# EAGLE design LearningBoard (EAGLE 7.3.0)
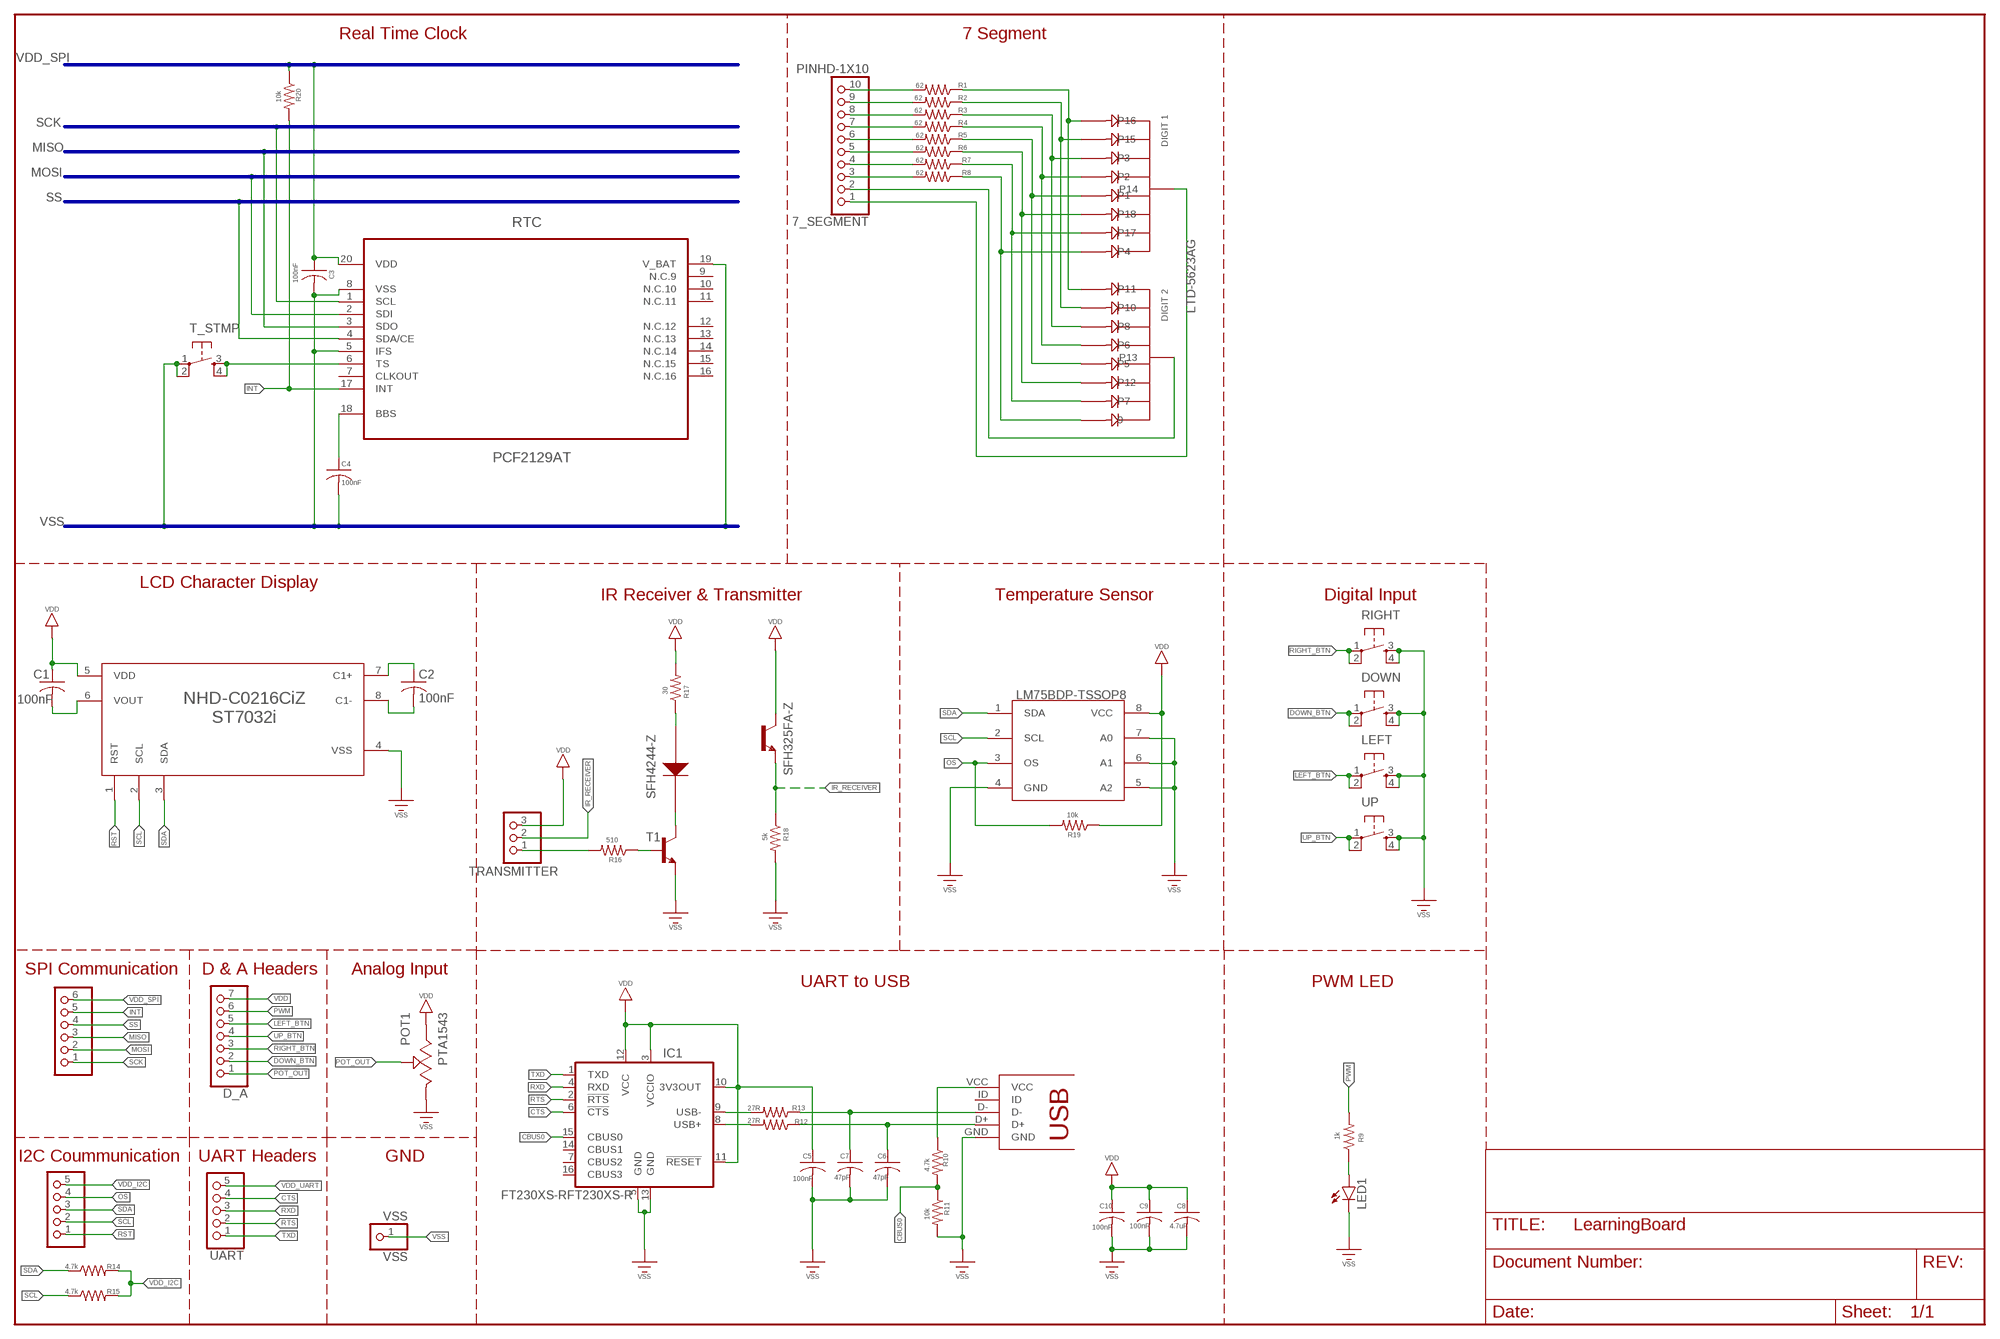
[diagram p0: schematic, sheet 1]

## Parts
7_SEGMENT  PINHD-1X10  [1X10-BIG]
C1  100nF  C-USC0805  [C0805]
C2  100nF  C-USC0805  [C0805]
C3  100nF  C-USC0805  [C0805]
C4  100nF  C-USC0805  [C0805]
C5  100nF  C-USC0805  [C0805]
C6  47pF  C-USC0805  [C0805]
C7  47pF  C-USC0805  [C0805]
C8  4.7uF  C-USC0805  [C0805]
C9  100nF  C-USC0805  [C0805]
C10  100nF  C-USC0805  [C0805]
D_A  PINHD-1X7  [1X07]
DOWN  TAC_SWITCHPTH  [TACTILE-PTH]
I2C  PINHD-1X5  [1X05]
IC1  FT230XS-RFT230XS-R  [FT230XS-R]
LED1  LED5MM  [LED5MM]
LEFT  TAC_SWITCHPTH  [TACTILE-PTH]
POT1  PTA1543  [PTA1543]
R1  62  RESISTOR0805-RES  [0805]
R2  62  RESISTOR0805-RES  [0805]
R3  62  RESISTOR0805-RES  [0805]
R4  62  RESISTOR0805-RES  [0805]
R5  62  RESISTOR0805-RES  [0805]
R6  62  RESISTOR0805-RES  [0805]
R7  62  RESISTOR0805-RES  [0805]
R8  62  RESISTOR0805-RES  [0805]
R9  1k  RESISTOR0805-RES  [0805]
R10  4.7k  RESISTOR0805-RES  [0805]
R11  10k  RESISTOR0805-RES  [0805]
R12  27R  RESISTOR0805-RES  [0805]
R13  27R  RESISTOR0805-RES  [0805]
R14  4.7k  RESISTOR0805-RES  [0805]
R15  4.7k  RESISTOR0805-RES  [0805]
R16  510  RESISTOR0805-RES  [0805]
R17  30  RESISTOR0805-RES  [0805]
R18  5k  RESISTOR0805-RES  [0805]
R19  10k  RESISTOR0805-RES  [0805]
R20  10k  RESISTOR0805-RES  [0805]
RECEIVER_  SFH325FA-Z  [SFH325FA-Z]
RIGHT  TAC_SWITCHPTH  [TACTILE-PTH]
SPI  PINHD-1X6  [1X06]
T1  MMBT3904LT1-NPN-SOT23-BEC  [SOT23-BEC]
T_STMP  TAC_SWITCHPTH  [TACTILE-PTH]
TRANSMITTER  PINHD-1X3  [1X03]
TRANSMITTER_  SFH4244-Z  [SFH4244-Z]
U$1  PCF2129AT  [PCF2129AT]
U$2  NHD-C0216CIZ-FN-FBW-3V  [NHD-C0216CIZ-FN-FBW-3V]
U$3  LTD-5623AG  [LTD-5623AG]
U$10  10118192-0001LF  [10118192-0001LF]
U$11  LM75BDP-TSSOP8  [TSSOP8]
UART  PINHD-1X5  [1X05]
UP  TAC_SWITCHPTH  [TACTILE-PTH]
VSS  VSS  PINHD-1X1  [1X01]

## Nets
CBUS0: IC1.15(CBUS0) R10.2 R11.1
CTS: IC1.6(!CTS) UART.4
DIN: R16.2 TRANSMITTER.1
DOWN_BTN: D_A.2 DOWN.1 DOWN.2
INT: R20.2 SPI.5 U$1.17(INT)
IR_RECEIVER: R18.1 RECEIVER_.E TRANSMITTER.2
LEFT_BTN: D_A.5 LEFT.1 LEFT.2
MISO: SPI.3 U$1.3(SDO)
MOSI: SPI.2 U$1.2(SDI)
N$1: C1.2 U$2.6(VOUT)
N$2: C2.1 U$2.7(C1+)
N$3: C2.2 U$2.8(C1-)
N$4: LED1.A R9.1
N$5: R1.1 U$3.P11 U$3.P16
N$6: R2.1 U$3.P10 U$3.P15
N$8: R4.1 U$3.P2 U$3.P6
N$9: R3.1 U$3.P3 U$3.P8
N$10: R5.1 U$3.P1 U$3.P5
N$11: R6.1 U$3.P12 U$3.P18
N$12: R7.1 U$3.P7 U$3.P17
N$13: R8.1 U$3.P4 U$3.P9
N$14: 7_SEGMENT.10 R1.2
N$15: 7_SEGMENT.9 R2.2
N$16: 7_SEGMENT.8 R3.2
N$17: 7_SEGMENT.7 R4.2
N$18: 7_SEGMENT.6 R5.2
N$19: 7_SEGMENT.5 R6.2
N$20: 7_SEGMENT.4 R7.2
N$21: 7_SEGMENT.3 R8.2
N$22: 7_SEGMENT.2 U$3.P13
N$23: 7_SEGMENT.1 U$3.P14
N$24: T1.C TRANSMITTER_.C
N$25: R17.1 TRANSMITTER_.A
N$26: R16.1 T1.B
N$27: T_STMP.3 T_STMP.4 U$1.6(TS)
N$30: C4.1 U$1.18(BBS)
N$33: IC1.9(USB-) R13.2
N$34: C7.1 R13.1 U$10.D-
N$35: C6.1 R12.1 U$10.D+
N$36: IC1.8(USB+) R12.2
N$38: R10.1 U$10.VCC
OS: I2C.4 R19.2 U$11.3(OS)
POT_OUT: D_A.1 POT1.2
PWM: D_A.6 R9.2
RIGHT_BTN: D_A.3 RIGHT.1 RIGHT.2
RST: I2C.1 U$2.1(RST)
RTS: IC1.2(!RTS) UART.2
RXD: IC1.4(RXD) UART.3
SCK: SPI.1 U$1.1(SCL)
SCL: I2C.2 R15.1 U$2.2(SCL) U$11.2(SCL)
SDA: I2C.3 R14.1 U$2.3(SDA) U$11.1(SDA)
SS: SPI.4 U$1.4(SDA/CE)
TXD: IC1.1(TXD) UART.1
UP_BTN: D_A.4 UP.1 UP.2
VDD: D_A.7 POT1.3
VDD_I2C: C1.1 I2C.5 R14.2 R15.2 R19.1 U$2.5(VDD) U$11.8(VCC) ; supply symbol labelled VDD
VDD_IR: R17.2 RECEIVER_.C TRANSMITTER.3 ; supply symbol labelled VDD
VDD_SPI: C3.1 R20.1 SPI.6 U$1.20(VDD)
VDD_UART: C5.1 C8.1 C9.1 C10.1 IC1.3(VCCIO) IC1.10(3V3OUT) IC1.11(!RESET) IC1.12(VCC) UART.5 ; supply symbol labelled VDD
VSS: C3.2 C4.2 C5.2 C6.2 C7.2 C8.2 C9.2 C10.2 DOWN.3 DOWN.4 IC1.5(GND) IC1.13(GND) LED1.K(C) LEFT.3 LEFT.4 POT1.1 R11.2 R18.2 RIGHT.3 RIGHT.4 T1.E T_STMP.1 T_STMP.2 U$1.5(IFS) U$1.8(VSS) U$1.19(V_BAT) U$2.4(VSS) U$10.GND U$11.4(GND) U$11.5(A2) U$11.6(A1) U$11.7(A0) UP.3 UP.4 VSS.1
Unconnected: IC1.7(CBUS2) IC1.14(CBUS1) IC1.16(CBUS3) U$1.7(CLKOUT) U$1.9(N.C.9) U$1.10(N.C.10) U$1.11(N.C.11) U$1.12(N.C.12) U$1.13(N.C.13) U$1.14(N.C.14) U$1.15(N.C.15) U$1.16(N.C.16) U$10.ID

## Buses
VDD_SPI
SCK
MISO
MOSI
SS
VSS

## Notes on the sheet
- Real Time Clock | 7 Segment
- LCD Character Display
- IR Receiver & Transmitter | Temperature Sensor | Digital Input
- SPI Communication | D & A Headers | Analog Input
- UART to USB | PWM LED
- I2C Coummunication | UART Headers | GND

## Library data of the parts
7_SEGMENT = adafruit:PINHD-1X10: Pin header 1x10 0.1" spacing With round pins
C1-C10 = resistor:C-US: CAPACITOR, American symbol
D_A = pinhead:PINHD-1X7: PIN HEADER
DOWN LEFT RIGHT T_STMP UP = SparkFun-Electromechanical:TAC_SWITCH: Momentary Switch Button commonly used for reset or general input. Spark Fun Electronics SKU : COM-00097 SMT- SWCH-08247
I2C UART = pinhead:PINHD-1X5: PIN HEADER
IC1 = AllAboutEE:FT230XS-R: BASIC USB to UART IC
LED1 = SparkFun-LED:LED: LEDs Standard schematic elements and footprints for 5mm, 3mm, 1206, and 0603 sized LEDs. 5mm - Spark Fun Electronics SKU : COM-00529 (and others)
POT1 = AllAboutEE:PTA1543: Slide Potentiometers 10MM SHAFT NO DET 15MM STRK SNG LIN 10 kOhms 50 mW 20 %; POWER_RATING: 50mW; RESISTANCE: 10kOhms; TOLERANCE: 20%
R1-R20 = SparkFun-Passives:RESISTOR: Resistor Basic schematic elements and footprints for 0603, 1206, and PTH resistors.
RECEIVER_ = AllAboutEE:SFH325FA-Z: PHOTOTRANSISTOR; IC_ON_MAX: 15mA; MF: Osram Opto Semiconductor; MPN: SFH 325 FA-Z; VCE_SAT: 150mV; WAVELENGTH: 980nm
SPI = pinhead:PINHD-1X6: PIN HEADER
T1 = transistor:*-NPN-: NPN Transistror BF959 corrected 2008.03.06
TRANSMITTER = pinhead:PINHD-1X3: PIN HEADER
TRANSMITTER_ = AllAboutEE:SFH4244-Z: Infrared Emitters - High Power HIGH PWR 940nm HALF ANGLE +/-60DEG
U$1 = AllAboutEE:PCF2129AT
U$2 = AllAboutEE:NHD-C0216CIZ-FN-FBW-3V: LCD Character Display Modules & Accessories; CONTROLLER: ST7032i-oD; COUNT_LINE: 16x2; DISPLAY_MODE: Transflective; INTERFACE: I2C; MANUFACTURER: Newhaven Display; VSUPPLY: 3v; VSUPPLY_MAX: 3.3v
U$3 = AllAboutEE:LTD-5623AG
U$10 = AllAboutEE:10118192-0001LF: USB Connectors 5P MICRO USB TYPE B RECEPTACLE.; COLOR: Black; GENDER: Female
U$11 = AllAboutEE:LM75BDP-TSSOP8; INTERFACE: I2C, 2-Wire, SMBus; MAX_OPERATING_TEMPERATURE: +125C; MINIMUM_OPERATING_TEMPERATURE: -55C; RESOLUTION: 11 bit; VSUPPLY_MAX: 5.5v; VSUPPLY_MIN: 2.8v
VSS = pinhead:PINHD-1X1: PIN HEADER

## Board
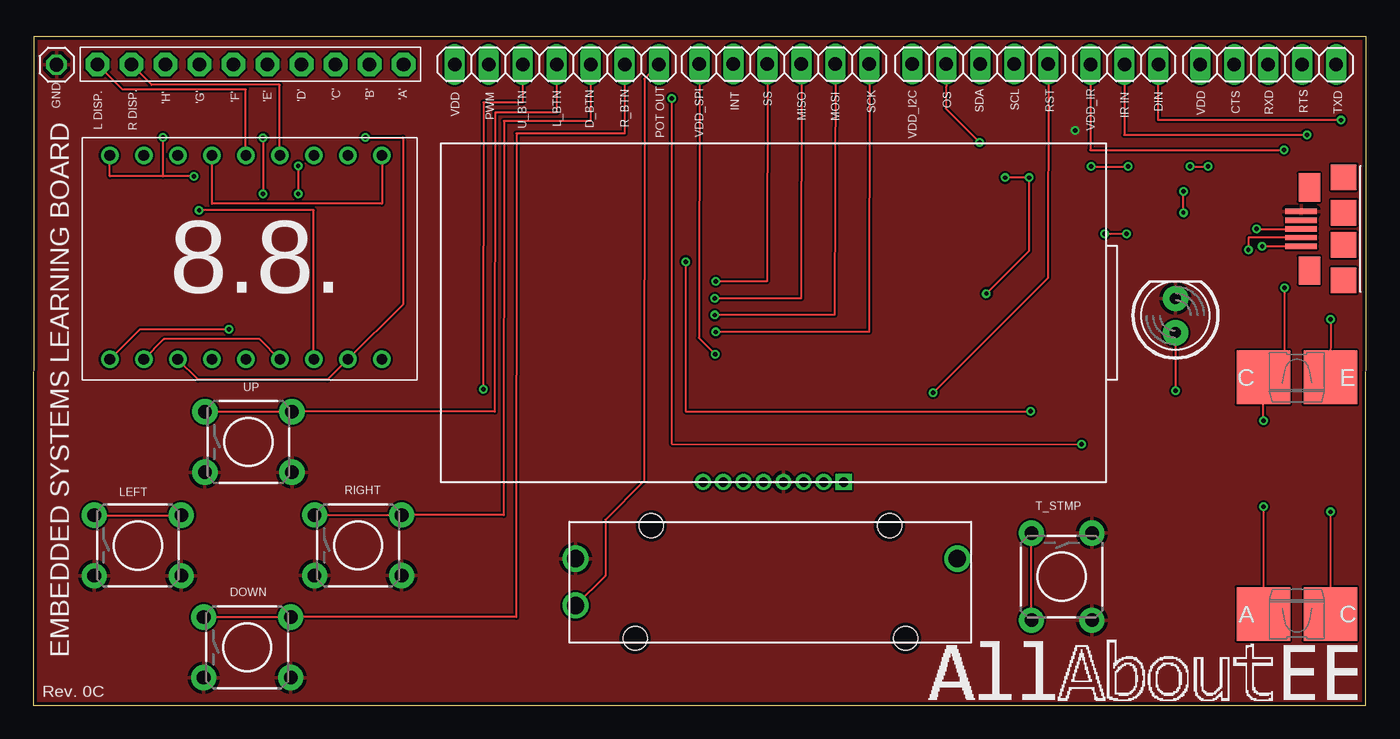
[diagram p1: board, top side]
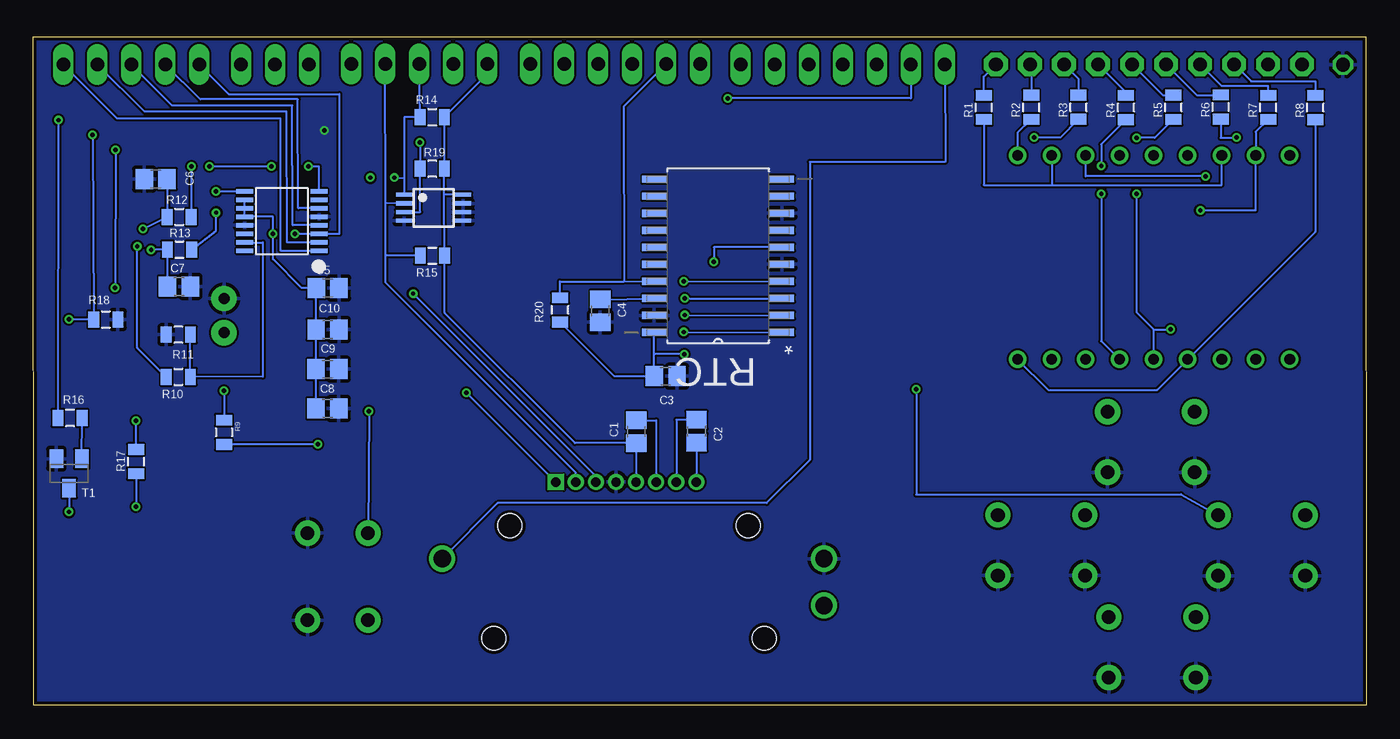
[diagram p2: board, bottom side, seen from below]

Size 99.49 x 49.93 mm. Coordinates in mm from the lower left corner, seen from the top.
Outline: 0,0 99.47,0 99.49,49.93 0.03,49.93 0,0
Copper layers (1*16): Top 0.035mm / dielectric 1.5mm / Bottom 0.035mm
Design rules "SeedStudio_2Layer": minimum track width 6mil, minimum drill 12mil, track to track 6mil, track to pad 6mil, pad to pad 6mil, via to via 6mil, smd to smd 0mil, copper to edge 10mil, drill to drill 10mil, minimum pad ring 10mil, minimum via ring 6mil, stop-mask expansion 2mil, vias tented up to drill 100mil, thermal gap 10mil

### Footprints (pad centres in the part's own frame; a part is rotated, then mirrored left to right if it is on the bottom)
1X10-BIG = drill 1.016 pad 1.778 octagon: 1 -11.43,0; 2 -8.89,0; 3 -6.35,0; 4 -3.81,0; 5 -1.27,0; 6 1.27,0; 7 3.81,0; 8 6.35,0; 9 8.89,0; 10 11.43,0
C0805 = smd 1.3 x 1.5: 1 -0.85,0; 2 0.85,0
1X07 = drill 1.016 long: 1 -7.62,0; 2 -5.08,0; 3 -2.54,0; 4 0,0; 5 2.54,0; 6 5.08,0; 7 7.62,0
TACTILE-PTH = drill 1.016 pad 1.88: 1 -3.251,2.261; 2 3.251,2.261; 3 -3.251,-2.261; 4 3.251,-2.261
1X05 = drill 1.016 long: 1 -5.08,0; 2 -2.54,0; 3 0,0; 4 2.54,0; 5 5.08,0
FT230XS-R = smd 0.32 x 1.26: 1 -2.223,-2.779; 2 -1.588,-2.779; 3 -0.953,-2.779; 4 -0.318,-2.779; 5 0.317,-2.779; 6 0.952,-2.779; 7 1.587,-2.779; 8 2.222,-2.779; 9 2.222,2.779; 10 1.587,2.779; 11 0.952,2.779; 12 0.317,2.779; 13 -0.318,2.779; 14 -0.953,2.779; 15 -1.588,2.779; 16 -2.223,2.779
LED5MM = drill 0.813 pad 1.88: A -1.27,0; K 1.27,0
PTA1543 = drill 1.3: 1 0.45,6.25; 2 0.45,2.75; 3 28.95,6.25 | hole 1.8: 4.9,0.3; 6.1,8.7; 23.9,8.7; 25.1,0.3
0805 = smd 0.8 x 1.2: 1 -0.9,0; 2 0.9,0
SFH325FA-Z = smd 4 x 4: C 0,-2.5; E 0,2.5
1X06 = drill 1.016 long: 1 -6.35,0; 2 -3.81,0; 3 -1.27,0; 4 1.27,0; 5 3.81,0; 6 6.35,0
SOT23-BEC = smd 1 x 1.4: B -0.95,-1.1; C 0,1.1; E 0.95,-1.1
1X03 = drill 1.016 long: 1 -2.54,0; 2 0,0; 3 2.54,0
SFH4244-Z = smd 4 x 4: A 0,2.5; C 0,-2.5
PCF2129AT = smd 1.803 x 0.533: 1 -4.775,5.715; 2 -4.775,4.445; 3 -4.775,3.175; 4 -4.775,1.905; 5 -4.775,0.635; 6 -4.775,-0.635; 7 -4.775,-1.905; 8 -4.775,-3.175; 9 -4.775,-4.445; 10 -4.775,-5.715; 11 4.775,-5.715; 12 4.775,-4.445; 13 4.775,-3.175; 14 4.775,-1.905; 15 4.775,-0.635; 16 4.775,0.635; 17 4.775,1.905; 18 4.775,3.175; 19 4.775,4.445; 20 4.775,5.715
NHD-C0216CIZ-FN-FBW-3V = drill 0.7 square: 1 30.1,-25.3 | drill 0.7: 2 28.6,-25.3; 3 27.1,-25.3; 4 25.6,-25.3; 5 24.1,-25.3; 6 22.6,-25.3; 7 21.1,-25.3; 8 19.6,-25.3
LTD-5623AG = drill 0.8: P1 2.04,1.54; P2 4.58,1.54; P3 7.12,1.54; P4 9.66,1.54; P5 12.2,1.54; P6 14.74,1.54; P7 17.28,1.54; P8 19.82,1.54; P9 22.36,1.54; P10 22.36,16.78; P11 19.82,16.78; P12 17.28,16.78; P13 14.74,16.78; P14 12.2,16.78; P15 9.66,16.78; P16 7.12,16.78; P17 4.58,16.78; P18 2.04,16.78
10118192-0001LF = smd 0.4 x 2.35: D+ -0.05,1.725; D- -0.7,1.725; GND 1.25,1.725; ID 0.6,1.725; VCC -1.35,1.725 | smd 2.1 x 1.6: P$1 -3.15,1.1; P$2 3.05,1.1 | smd 1.9 x 1.9: P$3 -3.9,-1.45; P$4 -1.25,-1.45; P$5 1.15,-1.45; P$6 3.8,-1.45
TSSOP8 = smd 1.2 x 0.305: 1 -2.2,0.975; 2 -2.2,0.325; 3 -2.2,-0.325; 4 -2.2,-0.975; 5 2.2,-0.975; 6 2.2,-0.325; 7 2.2,0.325; 8 2.2,0.975
1X01 = drill 1.016 octagon: 1 0,0

### Placement (x,y rotation side)
7_SEGMENT  16.2,47.85 0 top
C1  54.49,20.42 90 bottom
C2  49.99,20.46 270 bottom
C3  52.29,24.57 0 bottom
C4  57.17,29.44 270 bottom
C5  77.53,31.15 0 bottom
C6  90.36,39.28 180 bottom
C7  88.64,31.26 0 bottom
C8  77.55,22.15 0 bottom
C9  77.55,25.09 0 bottom
C10  77.54,28.05 0 bottom
D_A  39.07,47.85 180 top
DOWN  15.96,4.32 0 top
I2C  70.69,47.87 180 top
IC1  80.95,36.15 90 bottom
LED1  85.27,29.08 90 top
LEFT  7.79,11.92 0 top
POT1  40.02,4.69 0 top
R1  28.54,44.63 90 bottom
R2  25,44.65 90 bottom
R3  21.47,44.65 90 bottom
R4  17.93,44.63 90 bottom
R5  14.39,44.65 90 bottom
R6  10.84,44.66 90 bottom
R7  7.31,44.64 90 bottom
R8  3.79,44.63 90 bottom
R9  85.27,20.37 270 bottom
R10  88.68,24.51 0 bottom
R11  88.68,27.67 180 bottom
R12  88.61,36.45 0 bottom
R13  88.59,34.02 0 bottom
R14  69.73,43.91 0 bottom
R15  69.7,33.56 0 bottom
R16  96.76,21.44 180 bottom
R17  91.83,18.19 90 bottom
R18  94.09,28.8 0 bottom
R19  69.72,40.06 180 bottom
R20  60.18,29.51 90 bottom
RECEIVER_  94.34,24.48 270 top
RIGHT  24.24,11.93 0 top
SPI  56.06,47.87 180 top
T1  96.83,17.3 180 bottom
T_STMP  76.77,9.59 270 top
TRANSMITTER  81.46,47.85 180 top
TRANSMITTER_  94.34,6.81 90 top
U$1  48.37,33.56 180 bottom
U$2  30.4,41.96 0 top
U$3  3.65,24.28 0 top
U$10  96.37,35.62 90 top
U$11  69.62,37.15 0 bottom
UART  92.18,47.84 180 top
UP  16.05,19.65 0 top
VSS  1.73,47.83 0 top

### Tracks (layer width: path | path; a pad name or v marks a point on that pad's centre or on a via)
CBUS0
  Bottom 0.152: R11.1 R10.2 82.37,24.54 82.37,34.56 IC1.15
CTS
  Bottom 0.152: IC1.6 79.73,37.1 79.76,45.24 87.04,45.24 UART.4
DIN  (via drill 0.33)
  Top 0.152: v97.61,43.69 83.97,43.69 TRANSMITTER.1
  Bottom 0.152: R16.2 v97.61,43.69
DOWN_BTN
  Top 0.152: DOWN.1 DOWN.2 36.04,6.58 36.07,42.68 44.15,42.68 D_A.2
INT
  Bottom 0.152: SPI.5 55.42,44.7 55.4,31.65 | 55.4,31.65 U$1.17 | R20.2 60.18,31.65 55.4,31.65
IR_RECEIVER  (via drill 0.33)
  Top 0.152: v96.85,28.8 RECEIVER_.E | TRANSMITTER.2 81.43,42.6 v95.07,42.6
  Bottom 0.152: v96.85,28.8 R18.1 v95.07,42.6
LEFT_BTN  (via drill 0.33)
  Top 0.152: LEFT.1 LEFT.2 | D_A.5 36.53,45.01 33.6,45.01 v33.58,23.6
  Bottom 0.152: v33.58,23.6 33.58,15.72 13.82,15.75 LEFT.2
MISO  (via drill 0.33)
  Top 0.152: SPI.3 57.3,30.38 v50.88,30.38
  Bottom 0.152: v50.88,30.38 U$1.3
MOSI  (via drill 0.33)
  Top 0.152: SPI.2 59.82,29.13 v50.88,29.13
  Bottom 0.152: v50.88,29.13 U$1.2
N$1
  Bottom 0.152: C1.2 53,21.27 U$2.6
N$2
  Bottom 0.152: C2.1 51.5,21.31 U$2.7
N$3
  Bottom 0.152: C2.2 U$2.8
N$4  (via drill 0.33)
  Top 0.152: LED1.A v85.27,23.47
  Bottom 0.152: v85.27,23.47 R9.1
N$5
  Bottom 0.152: U$3.P11 23.47,38.84 | 23.47,38.84 10.77,38.84 U$3.P16 | R1.1 28.54,38.84 23.47,38.84
N$6
  Top 0.152: U$3.P10 26.01,37.44 13.31,37.44 U$3.P15
  Bottom 0.152: R2.1 26.01,42.74 U$3.P10
N$8  (via drill 0.33)
  Top 0.152: U$3.P6 16.88,27.33 9.73,27.33 U$3.P2 | v19.76,40.28 v19.76,38.18
  Bottom 0.152: v19.76,38.18 19.76,27.19 U$3.P6 | R4.1 19.76,41.89 v19.76,40.28
N$9  (via drill 0.33)
  Top 0.152: v24.79,42.39 27.58,42.39 27.58,29.92 U$3.P8 21.96,24.31 12.29,24.31 U$3.P3
  Bottom 0.152: R3.1 22.83,42.39 v24.79,42.39
N$10  (via drill 0.33)
  Top 0.152: v17.14,42.37 v17.14,38.18 | v14.61,28.07 7.94,28.07 U$3.P1
  Bottom 0.152: U$3.P5 15.85,28.07 | 15.85,28.07 v14.61,28.07 | v17.14,38.18 17.14,29.36 15.85,28.07 | R5.1 15.77,42.37 v17.14,42.37
N$11  (via drill 0.33)
  Top 0.152: v11.99,39.5 9.65,39.5 | 9.65,39.5 5.69,39.5 U$3.P18 | v9.65,42.39 9.65,39.5
  Bottom 0.152: R6.1 10.84,42.37 v9.65,42.39 | v11.99,39.5 20.93,39.5 U$3.P12
N$12  (via drill 0.33)
  Top 0.152: U$3.P7 20.93,36.96 v12.37,36.96
  Bottom 0.152: R7.1 8.23,42.81 U$3.P17 8.23,36.96 v12.37,36.96
N$13
  Bottom 0.152: U$3.P9 23.71,23.52 15.6,23.52 15.6,23.54 U$3.P4 3.79,35.34 R8.1
N$14
  Bottom 0.152: R1.2 28.54,46.94 7_SEGMENT.10
N$15
  Bottom 0.152: 7_SEGMENT.9 25,47.76 R2.2
N$16
  Bottom 0.152: 7_SEGMENT.8 21.47,46.77 R3.2
N$17
  Bottom 0.152: 7_SEGMENT.7 17.93,45.77 R4.2
N$18
  Bottom 0.152: 7_SEGMENT.6 15.17,45.55 R5.2
N$19
  Bottom 0.152: 7_SEGMENT.5 12.64,45.56 R6.2
N$20
  Bottom 0.152: 7_SEGMENT.4 10.79,46.25 7.32,46.25 R7.2
N$21
  Bottom 0.152: 7_SEGMENT.3 8.58,46.58 3.79,46.58 R8.2
N$22
  Top 0.152: U$3.P13 18.39,46.33 8.81,46.33 7_SEGMENT.2
N$23
  Top 0.152: U$3.P14 15.85,45.97 6.66,45.97 7_SEGMENT.1
N$24  (via drill 0.33)
  Top 0.152: v96.83,14.43 TRANSMITTER_.C
  Bottom 0.152: T1.C v96.83,14.43
N$25  (via drill 0.33)
  Top 0.152: v91.83,14.82 TRANSMITTER_.A
  Bottom 0.152: R17.1 v91.83,14.82
N$26
  Bottom 0.152: T1.B R16.1
N$27  (via drill 0.33)
  Top 0.152: T_STMP.4 T_STMP.3 | v48.69,33.12 48.69,21.95 v74.45,21.95
  Bottom 0.152: U$1.6 48.69,34.19 v48.69,33.12 | v74.45,21.95 T_STMP.3
N$30
  Bottom 0.152: C4.1 U$1.18
N$33  (via drill 0.33)
  Top 0.152: v85.85,36.78 v85.86,38.37
  Bottom 0.152: R13.2 85.85,35.45 v85.85,36.78 | v85.86,38.37 IC1.9
N$34  (via drill 0.33)
  Top 0.152: U$10.D- 90.7,34.91 v90.7,34.01
  Bottom 0.152: C7.1 R13.1 v90.7,34.01
N$35  (via drill 0.33)
  Top 0.152: v91.31,35.56 U$10.D+
  Bottom 0.152: C6.1 R12.1 v91.31,35.56
N$36  (via drill 0.33)
  Top 0.152: v78.97,40.23 v81.74,40.23 | v86.36,40.23 v87.71,40.23
  Bottom 0.152: IC1.8 78.17,40.23 v78.97,40.23 | v81.74,40.23 v86.36,40.23 | v87.71,40.23 R12.2
N$38  (via drill 0.33)
  Top 0.152: v91.75,34.27 U$10.VCC
  Bottom 0.152: R10.1 91.75,26.68 v91.75,34.27
OS  (via drill 0.33)
  Top 0.152: I2C.4 68.12,44.55 v70.64,42.04
  Bottom 0.152: U$11.3 70.62,36.82 R19.2 v70.64,42.04
POT_OUT
  Top 0.152: D_A.1 45.62,46.78 45.59,16.74 42.7,13.84 42.7,9.65 POT1.2
PWM  (via drill 0.33)
  Top 0.152: v47.65,45.31 47.65,19.51 v78.26,19.48
  Bottom 0.152: D_A.6 33.99,45.31 v47.65,45.31 | v78.26,19.48 R9.2
RIGHT_BTN
  Top 0.152: RIGHT.1 RIGHT.2 35.1,14.19 35.13,43.61 41.61,43.61 D_A.3
RST  (via drill 0.33)
  Top 0.152: I2C.1 75.74,31.9 v67.18,23.34
  Bottom 0.152: v67.18,23.34 U$2.1
RTS
  Bottom 0.152: IC1.2 80.57,34.56 80.59,44.32 91.2,44.32 UART.2
RXD
  Bottom 0.152: IC1.4 80.14,35.83 80.16,44.78 89.12,44.78 UART.3
SCK  (via drill 0.33)
  Top 0.152: SPI.1 62.38,27.86 v50.93,27.86
  Bottom 0.152: v50.93,27.86 U$1.1
SCL
  Bottom 0.152: U$11.2 73.2,37.5 | 73.2,37.5 I2C.2 | R15.1 73.2,33.56 | 73.2,33.56 73.2,37.5 | U$2.2 59,17.34 73.2,31.57 73.2,33.56
SDA  (via drill 0.33)
  Top 0.152: v72.54,39.4 v74.35,39.4 74.35,33.93 v71.14,30.73
  Bottom 0.152: 71.82,39.34 71.82,43.91 R14.1 I2C.3 | 71.82,39.34 U$11.1 | v72.54,39.4 71.82,39.34 | U$2.3 57.5,17.09 v71.14,30.73
SS  (via drill 0.33)
  Top 0.152: SPI.4 54.76,31.65 v50.93,31.65
  Bottom 0.152: v50.93,31.65 U$1.4
TXD
  Bottom 0.152: IC1.1 81.03,33.92 81.05,43.81 93.24,43.81 UART.1
UP_BTN
  Top 0.152: UP.1 UP.2 34.44,21.91 34.47,44.25 39.07,44.25 D_A.4
VDD
  Bottom 0.152: D_A.7 31.42,40.56 41.53,40.56 41.53,18.31 44.76,15.09 64.82,15.09 POT1.3
VDD_I2C
  Bottom 0.152: U$11.8 68.83,38.12 | 68.83,38.12 R19.1 R14.2 65.61,47.12 I2C.5 | 68.83,38.12 R15.2 68.78,29.29 59.07,19.57 C1.1 U$2.5
VDD_IR  (via drill 0.33)
  Top 0.152: v91.83,21.24 RECEIVER_.C 93.4,26.04 v93.4,31.17 | TRANSMITTER.3 78.89,41.45 v93.37,41.45
  Bottom 0.152: R17.2 v91.83,21.24 | v93.37,41.45 v93.4,31.17
VDD_SPI  (via drill 0.33)
  Top 0.152: SPI.6 49.68,27.43 v50.9,26.21
  Bottom 0.152: 53.15,26.24 C3.1 56.14,24.57 R20.1 | 53.15,26.24 U$1.20 | v50.9,26.21 53.12,26.21 53.15,26.24
VDD_UART  (via drill 0.33)
  Top 0.152: v79.98,35.2 v81.61,35.2
  Bottom 0.152: C8.1 C9.1 C10.1 C5.1 79.46,31.15 81.61,33.3 v81.61,35.2 81.61,36.47 IC1.12 IC1.11 IC1.10 | v79.98,35.2 IC1.3 76.66,35.2 76.66,45.64 84.91,45.64 UART.5
VSS  (via drill 0.33)
  other vias: 77.77,42.93
  pour Top: -2.57,52.2 102.01,52.15 102.01,-2.59 -2.57,-2.54
  pour Bottom: -1.22,50.9 100.56,50.9 100.56,-1.24 -1.22,-1.24

### Text on the board
tPlace: EMBEDDED SYSTEMS LEARNING BOARD | Rev. 0C
tNames: GND | 'H' | 'G' | 'F' | 'E' | 'D' | 'C' | 'B' | 'A' | SS | OS | VDD | PWM | INT | MISO | MOSI | SCK | SDA | SCL | RST | IR IN | DIN | VDD | CTS | RXD | RTS | TXD | L DISP. | R DISP. | U_BTN | L_BTN | D_BTN | R_BTN | VDD_IR | POT OUT | VDD_SPI | VDD_I2C